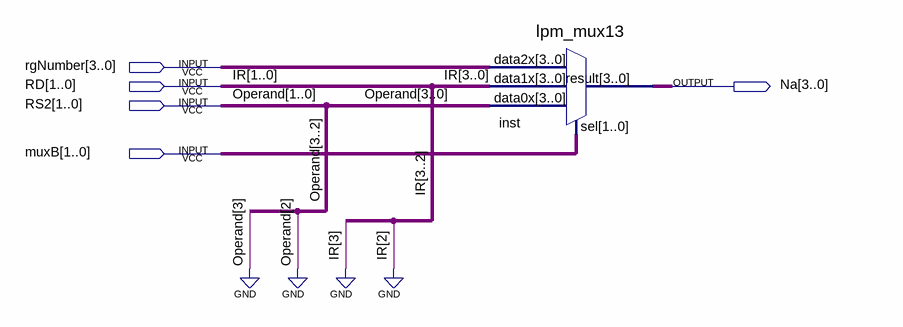
[diagram p0: schematic sheet]
// Quartus schematic muxB.bdf as structural Verilog: 1 symbols, 5 pins
module muxB (
  input  [3:0] rgNumber,
  input  [1:0] RD,
  input  [1:0] RS2,
  input  [1:0] muxB,
  output [3:0] Na
);

  lpm_mux13 inst (.data2x(rgNumber), .data1x({2'b00, RD}), .data0x({2'b00, RS2}), .sel(muxB), .result(Na));

  // Other names for the same wires on the sheet: IR[1:0] = RD; Operand[1:0] = RS2
endmodule
